# Altium schematic sheet Sensors_Sch.SchDoc
size B
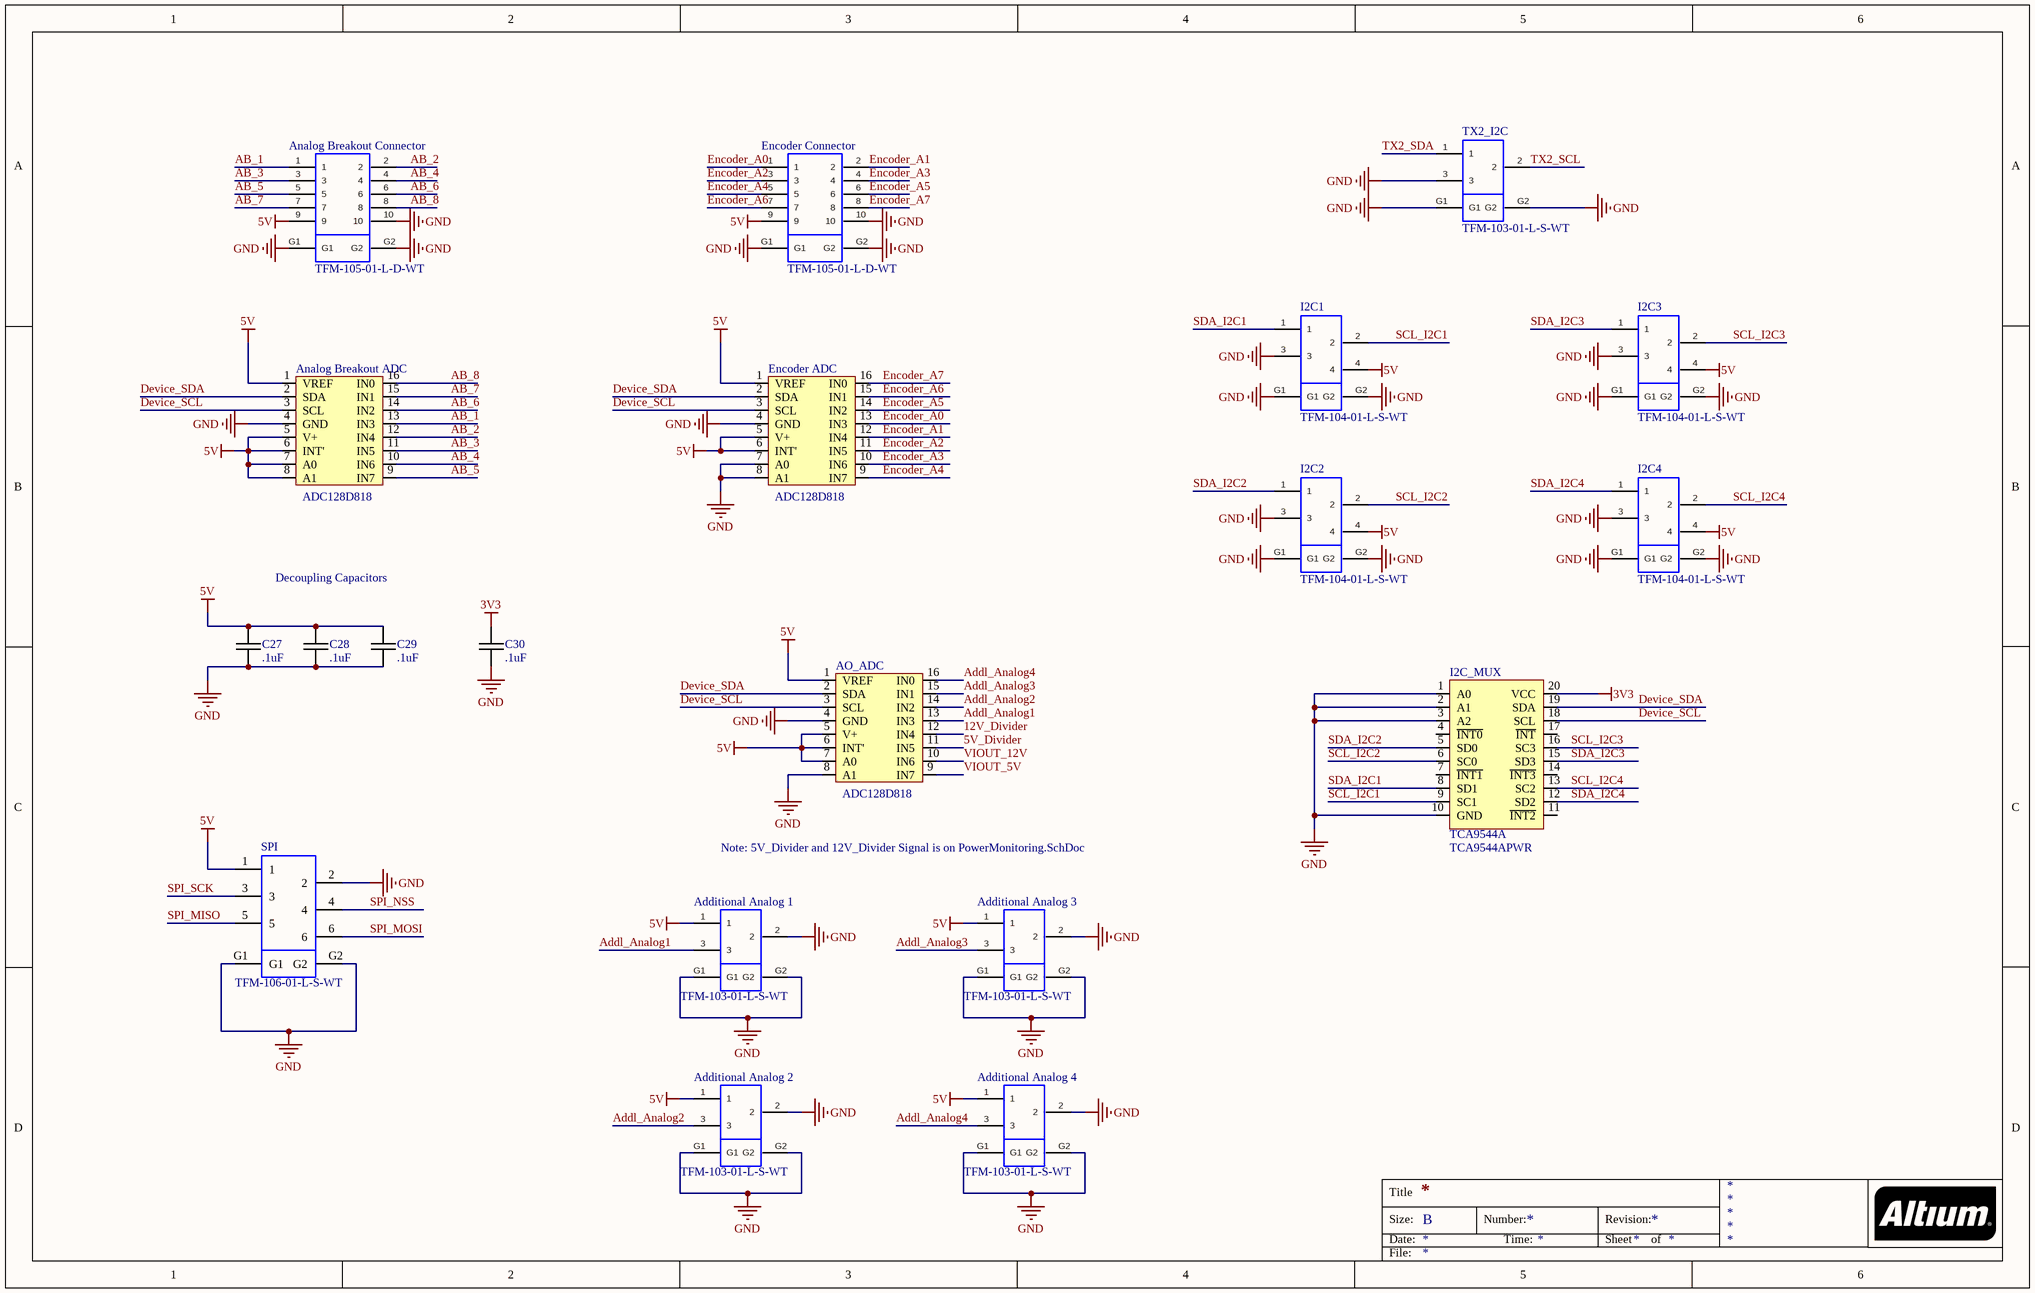
[diagram p0: Sensors_Sch.SchDoc]

## Parts
Additional_Analog_1  TFM-103-01-L-S-WT  [TFM-103-01-L-S-WT]
Additional_Analog_2  TFM-103-01-L-S-WT  [TFM-103-01-L-S-WT]
Additional_Analog_3  TFM-103-01-L-S-WT  [TFM-103-01-L-S-WT]
Additional_Analog_4  TFM-103-01-L-S-WT  [TFM-103-01-L-S-WT]
Analog_Breakout_ADC  ADC128D818  [ADC128D818 V3]
Analog_Breakout_Connector  TFM-105-01-L-D-WT  [TFM-105-01-L-D-WT]
AO_ADC  ADC128D818  [ADC128D818 V3]
C27  .1uF  [0805C-GENERIC]
C28  .1uF  [0805C-GENERIC]
C29  .1uF  [0805C-GENERIC]
C30  .1uF  [0805C-GENERIC]
Encoder_ADC  ADC128D818  [ADC128D818 V3]
Encoder_Connector  TFM-105-01-L-D-WT  [TFM-105-01-L-D-WT]
I2C1  TFM-104-01-L-S-WT  [TFM-104-01-L-S-WT]
I2C2  TFM-104-01-L-S-WT  [TFM-104-01-L-S-WT]
I2C3  TFM-104-01-L-S-WT  [TFM-104-01-L-S-WT]
I2C4  TFM-104-01-L-S-WT  [TFM-104-01-L-S-WT]
I2C_MUX  TCA9544A  Supplier Part Number 1: TCA9544APWR  [TSSOP20]
SPI  TFM-106-01-L-S-WT  [TFM-106-01-L-S-WT]
TX2_I2C  TFM-103-01-L-S-WT  [TFM-103-01-L-S-WT]

## Nets
3V3: C30.1 I2C_MUX.20(VCC)
5V: Additional_Analog_1.1 Additional_Analog_2.1 Additional_Analog_3.1 Additional_Analog_4.1 Analog_Breakout_ADC.1(VREF) Analog_Breakout_ADC.5(V+) Analog_Breakout_ADC.6(INT') Analog_Breakout_ADC.7(A0) Analog_Breakout_ADC.8(A1) Analog_Breakout_Connector.9 AO_ADC.1(VREF) AO_ADC.5(V+) AO_ADC.6(INT') AO_ADC.7(A0) C27.1 C28.1 C29.1 Encoder_ADC.1(VREF) Encoder_ADC.5(V+) Encoder_ADC.6(INT') Encoder_Connector.9 I2C1.4 I2C2.4 I2C3.4 I2C4.4 SPI.1
GND: Additional_Analog_1.2 Additional_Analog_1.G1 Additional_Analog_1.G2 Additional_Analog_2.2 Additional_Analog_2.G1 Additional_Analog_2.G2 Additional_Analog_3.2 Additional_Analog_3.G1 Additional_Analog_3.G2 Additional_Analog_4.2 Additional_Analog_4.G1 Additional_Analog_4.G2 Analog_Breakout_ADC.4(GND) Analog_Breakout_Connector.10 Analog_Breakout_Connector.G1 Analog_Breakout_Connector.G2 AO_ADC.4(GND) AO_ADC.8(A1) C27.2 C28.2 C29.2 C30.2 Encoder_ADC.4(GND) Encoder_ADC.7(A0) Encoder_ADC.8(A1) Encoder_Connector.10 Encoder_Connector.G1 Encoder_Connector.G2 I2C1.3 I2C1.G1 I2C1.G2 I2C2.3 I2C2.G1 I2C2.G2 I2C3.3 I2C3.G1 I2C3.G2 I2C4.3 I2C4.G1 I2C4.G2 I2C_MUX.1(A0) I2C_MUX.2(A1) I2C_MUX.3(A2) I2C_MUX.10(GND) SPI.2 SPI.G1 SPI.G2 TX2_I2C.3 TX2_I2C.G1 TX2_I2C.G2
5V_Divider: AO_ADC.11(IN5)
12V_Divider: AO_ADC.12(IN4)
AB_1: Analog_Breakout_ADC.13(IN3) Analog_Breakout_Connector.1
AB_2: Analog_Breakout_ADC.12(IN4) Analog_Breakout_Connector.2
AB_3: Analog_Breakout_ADC.11(IN5) Analog_Breakout_Connector.3
AB_4: Analog_Breakout_ADC.10(IN6) Analog_Breakout_Connector.4
AB_5: Analog_Breakout_ADC.9(IN7) Analog_Breakout_Connector.5
AB_6: Analog_Breakout_ADC.14(IN2) Analog_Breakout_Connector.6
AB_7: Analog_Breakout_ADC.15(IN1) Analog_Breakout_Connector.7
AB_8: Analog_Breakout_ADC.16(IN0) Analog_Breakout_Connector.8
Addl_Analog1: Additional_Analog_1.3 AO_ADC.13(IN3)
Addl_Analog2: Additional_Analog_2.3 AO_ADC.14(IN2)
Addl_Analog3: Additional_Analog_3.3 AO_ADC.15(IN1)
Addl_Analog4: Additional_Analog_4.3 AO_ADC.16(IN0)
Device_SCL: Analog_Breakout_ADC.3(SCL) AO_ADC.3(SCL) Encoder_ADC.3(SCL) I2C_MUX.18(SCL)
Device_SDA: Analog_Breakout_ADC.2(SDA) AO_ADC.2(SDA) Encoder_ADC.2(SDA) I2C_MUX.19(SDA)
Encoder_A0: Encoder_ADC.13(IN3) Encoder_Connector.1
Encoder_A1: Encoder_ADC.12(IN4) Encoder_Connector.2
Encoder_A2: Encoder_ADC.11(IN5) Encoder_Connector.3
Encoder_A3: Encoder_ADC.10(IN6) Encoder_Connector.4
Encoder_A4: Encoder_ADC.9(IN7) Encoder_Connector.5
Encoder_A5: Encoder_ADC.14(IN2) Encoder_Connector.6
Encoder_A6: Encoder_ADC.15(IN1) Encoder_Connector.7
Encoder_A7: Encoder_ADC.16(IN0) Encoder_Connector.8
SCL_I2C1: I2C1.2 I2C_MUX.9(SC1)
SCL_I2C2: I2C2.2 I2C_MUX.6(SC0)
SCL_I2C3: I2C3.2 I2C_MUX.16(SC3)
SCL_I2C4: I2C4.2 I2C_MUX.13(SC2)
SDA_I2C1: I2C1.1 I2C_MUX.8(SD1)
SDA_I2C2: I2C2.1 I2C_MUX.5(SD0)
SDA_I2C3: I2C3.1 I2C_MUX.15(SD3)
SDA_I2C4: I2C4.1 I2C_MUX.12(SD2)
SPI_MISO: SPI.5
SPI_MOSI: SPI.6
SPI_NSS: SPI.4
SPI_SCK: SPI.3
TX2_SCL: TX2_I2C.2
TX2_SDA: TX2_I2C.1
VIOUT_5V: AO_ADC.9(IN7)
VIOUT_12V: AO_ADC.10(IN6)

Not connected (* = marked no-connect by the designer): I2C_MUX 4(~{INT0}) 7(~{INT1}) 11(~{INT2}) 14(~{INT3}) 17(~{INT})

## Notes on the sheet
- Decoupling Capacitors
- Note: 5V_Divider and 12V_Divider Signal is on PowerMonitoring.SchDoc
- Title
- Size:
- Date:
- B
- Number:
- Time:
- Revision:
- Sheet
- of
- File:

## Library data of the parts
C27-C30 = 0805C-TBD: CAPACITOR 0805 CERAMIC VALUE TO BE DETERMINED
I2C_MUX = TCA9544A: Supplier 1: Arrow Electronics, Inc.
SPI = TFM-106-01-L-S-WT: Supplier 1: Digi-Key; Supplier Part Number 1: TFM-106-01-L-S-WT